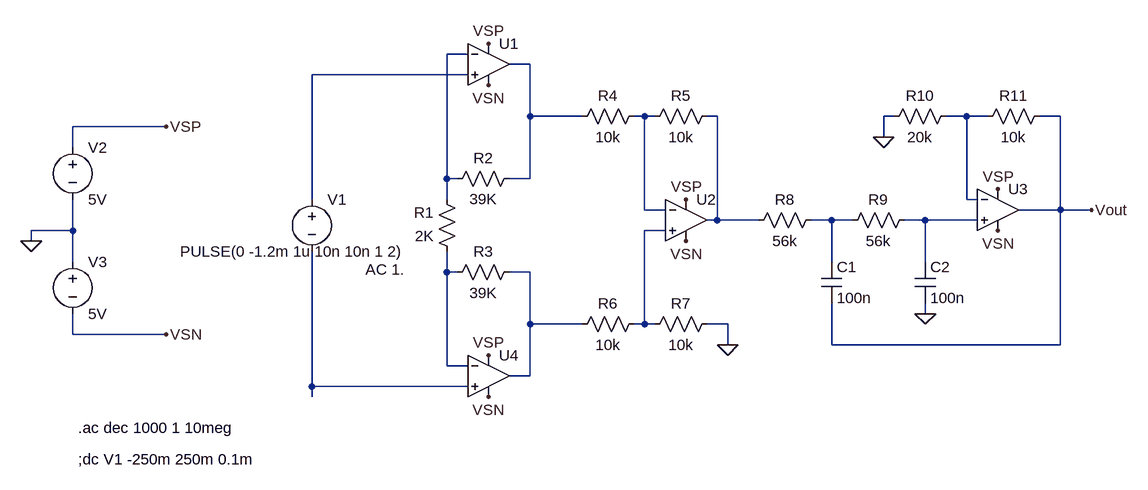
[diagram p0: schematic Ex5.asc]
Ex5.asc, the LTspice schematic file:
Version 4
SHEET 1 968 680
WIRE -64 -144 -96 -144
WIRE 32 -128 0 -128
WIRE -64 -112 -304 -112
WIRE 32 -48 32 -128
WIRE 112 -48 32 -48
WIRE 208 -48 192 -48
WIRE 224 -48 208 -48
WIRE 320 -48 304 -48
WIRE 592 -48 576 -48
WIRE 704 -48 672 -48
WIRE 736 -48 704 -48
WIRE 848 -48 816 -48
WIRE -528 -32 -672 -32
WIRE 576 -16 576 -48
WIRE -672 0 -672 -32
WIRE -96 48 -96 -144
WIRE -80 48 -96 48
WIRE 32 48 32 -48
WIRE 32 48 0 48
WIRE -304 80 -304 -112
WIRE -96 80 -96 48
WIRE 704 80 704 -48
WIRE 720 80 704 80
WIRE 208 96 208 -48
WIRE 240 96 208 96
WIRE 848 96 848 -48
WIRE 848 96 784 96
WIRE 896 96 848 96
WIRE 320 112 320 -48
WIRE 320 112 304 112
WIRE 384 112 320 112
WIRE 496 112 464 112
WIRE 528 112 496 112
WIRE 640 112 608 112
WIRE 720 112 640 112
WIRE -672 128 -672 80
WIRE -672 128 -736 128
WIRE 240 128 208 128
WIRE -736 144 -736 128
WIRE -672 176 -672 128
WIRE 496 176 496 112
WIRE 640 176 640 112
WIRE -96 192 -96 160
WIRE -80 192 -96 192
WIRE 32 192 0 192
WIRE 640 256 640 240
WIRE 32 272 32 192
WIRE 112 272 32 272
WIRE 208 272 208 128
WIRE 208 272 192 272
WIRE 224 272 208 272
WIRE 336 272 304 272
WIRE -672 288 -672 256
WIRE -528 288 -672 288
WIRE 336 304 336 272
WIRE 496 304 496 240
WIRE 848 304 848 96
WIRE 848 304 496 304
WIRE -96 336 -96 192
WIRE -64 336 -96 336
WIRE 32 352 32 272
WIRE 32 352 0 352
WIRE -304 368 -304 160
WIRE -64 368 -304 368
WIRE -304 384 -304 368
FLAG 640 256 0
FLAG 576 -16 0
FLAG 336 304 0
FLAG -736 144 0
FLAG -528 -32 VSP
FLAG -32 320 VSP
FLAG -32 -160 VSP
FLAG 272 80 VSP
FLAG 752 64 VSP
FLAG -528 288 VSN
FLAG -32 384 VSN
FLAG 272 144 VSN
FLAG 752 128 VSN
FLAG -32 -96 VSN
FLAG 896 96 Vout
SYMBOL OpAmps\\UniversalOpamp2 -32 -128 R0
SYMATTR InstName U1
SYMBOL OpAmps\\UniversalOpamp2 272 112 R0
SYMATTR InstName U2
SYMBOL OpAmps\\UniversalOpamp2 752 96 R0
SYMATTR InstName U3
SYMBOL res -80 176 R180
WINDOW 0 36 76 Left 2
WINDOW 3 36 40 Left 2
SYMATTR InstName R1
SYMATTR Value 2K
SYMBOL res 16 32 R90
WINDOW 0 0 56 VBottom 2
WINDOW 3 32 56 VTop 2
SYMATTR InstName R2
SYMATTR Value 39K
SYMBOL res 16 176 R90
WINDOW 0 0 56 VBottom 2
WINDOW 3 32 56 VTop 2
SYMATTR InstName R3
SYMATTR Value 39K
SYMBOL res 208 -64 R90
WINDOW 0 0 56 VBottom 2
WINDOW 3 32 56 VTop 2
SYMATTR InstName R4
SYMATTR Value 10k
SYMBOL res 320 -64 R90
WINDOW 0 0 56 VBottom 2
WINDOW 3 32 56 VTop 2
SYMATTR InstName R5
SYMATTR Value 10k
SYMBOL res 208 256 R90
WINDOW 0 0 56 VBottom 2
WINDOW 3 32 56 VTop 2
SYMATTR InstName R6
SYMATTR Value 10k
SYMBOL res 320 256 R90
WINDOW 0 0 56 VBottom 2
WINDOW 3 32 56 VTop 2
SYMATTR InstName R7
SYMATTR Value 10k
SYMBOL res 480 96 R90
WINDOW 0 0 56 VBottom 2
WINDOW 3 32 56 VTop 2
SYMATTR InstName R8
SYMATTR Value 56k
SYMBOL res 624 96 R90
WINDOW 0 0 56 VBottom 2
WINDOW 3 32 56 VTop 2
SYMATTR InstName R9
SYMATTR Value 56k
SYMBOL res 688 -64 R90
WINDOW 0 0 56 VBottom 2
WINDOW 3 32 56 VTop 2
SYMATTR InstName R10
SYMATTR Value 20k
SYMBOL res 832 -64 R90
WINDOW 0 0 56 VBottom 2
WINDOW 3 32 56 VTop 2
SYMATTR InstName R11
SYMATTR Value 10k
SYMBOL cap 480 176 R0
SYMATTR InstName C1
SYMATTR Value 100n
SYMBOL cap 624 176 R0
SYMATTR InstName C2
SYMATTR Value 100n
SYMBOL voltage -304 64 R0
WINDOW 3 143 96 Right 2
WINDOW 123 143 124 Right 2
WINDOW 39 0 0 Left 0
SYMATTR Value PULSE(0 -1.2m 1u 10n 10n 1 2)
SYMATTR Value2 AC 1.
SYMATTR InstName V1
SYMBOL voltage -672 -16 R0
WINDOW 123 0 0 Left 0
WINDOW 39 0 0 Left 0
SYMATTR InstName V2
SYMATTR Value 5V
SYMBOL voltage -672 160 R0
WINDOW 123 0 0 Left 0
WINDOW 39 0 0 Left 0
SYMATTR InstName V3
SYMATTR Value 5V
SYMBOL OpAmps\\UniversalOpamp2 -32 352 R0
SYMATTR InstName U4
TEXT -664 480 Left 2 !;dc V1 -250m 250m 0.1m
TEXT -664 432 Left 2 !.ac dec 1000 1 10meg

The netlist it stands for:
* Ex5.asc
XU1 N003 N001 VSP VSN N002 level.2 Avol=1Meg GBW=10Meg Slew=10Meg ilimit=25m rail=0 Vos=0 phimargin=45 en=0 enk=0 in=0 ink=0 Rin=500Meg  ; pins IN+ IN- V+ V- OUT
XU2 N009 N004 VSP VSN N005 level.2 Avol=1Meg GBW=10Meg Slew=10Meg ilimit=25m rail=0 Vos=0 phimargin=45 en=0 enk=0 in=0 ink=0 Rin=500Meg  ; pins IN+ IN- V+ V- OUT
XU3 N008 N006 VSP VSN Vout level.2 Avol=1Meg GBW=10Meg Slew=10Meg ilimit=25m rail=0 Vos=0 phimargin=45 en=0 enk=0 in=0 ink=0 Rin=500Meg  ; pins IN+ IN- V+ V- OUT
R1 N010 N001 2K
R2 N002 N001 39K
R3 N011 N010 39K
R4 N004 N002 10k
R5 N005 N004 10k
R6 N009 N011 10k
R7 0 N009 10k
R8 N007 N005 56k
R9 N008 N007 56k
R10 N006 0 20k
R11 Vout N006 10k
C1 N007 Vout 100n
C2 N008 0 100n
V1 N003 N012 PULSE(0 -1.2m 1u 10n 10n 1 2) AC 1.
V2 VSP 0 5V
V3 0 VSN 5V
XU4 N012 N010 VSP VSN N011 level.2 Avol=1Meg GBW=10Meg Slew=10Meg ilimit=25m rail=0 Vos=0 phimargin=45 en=0 enk=0 in=0 ink=0 Rin=500Meg  ; pins IN+ IN- V+ V- OUT
;dc V1 -250m 250m 0.1m
.ac dec 1000 1 10meg
.lib UniversalOpamps2.sub
.backanno
.end